# Altium schematic sheet power.SchDoc
size A4
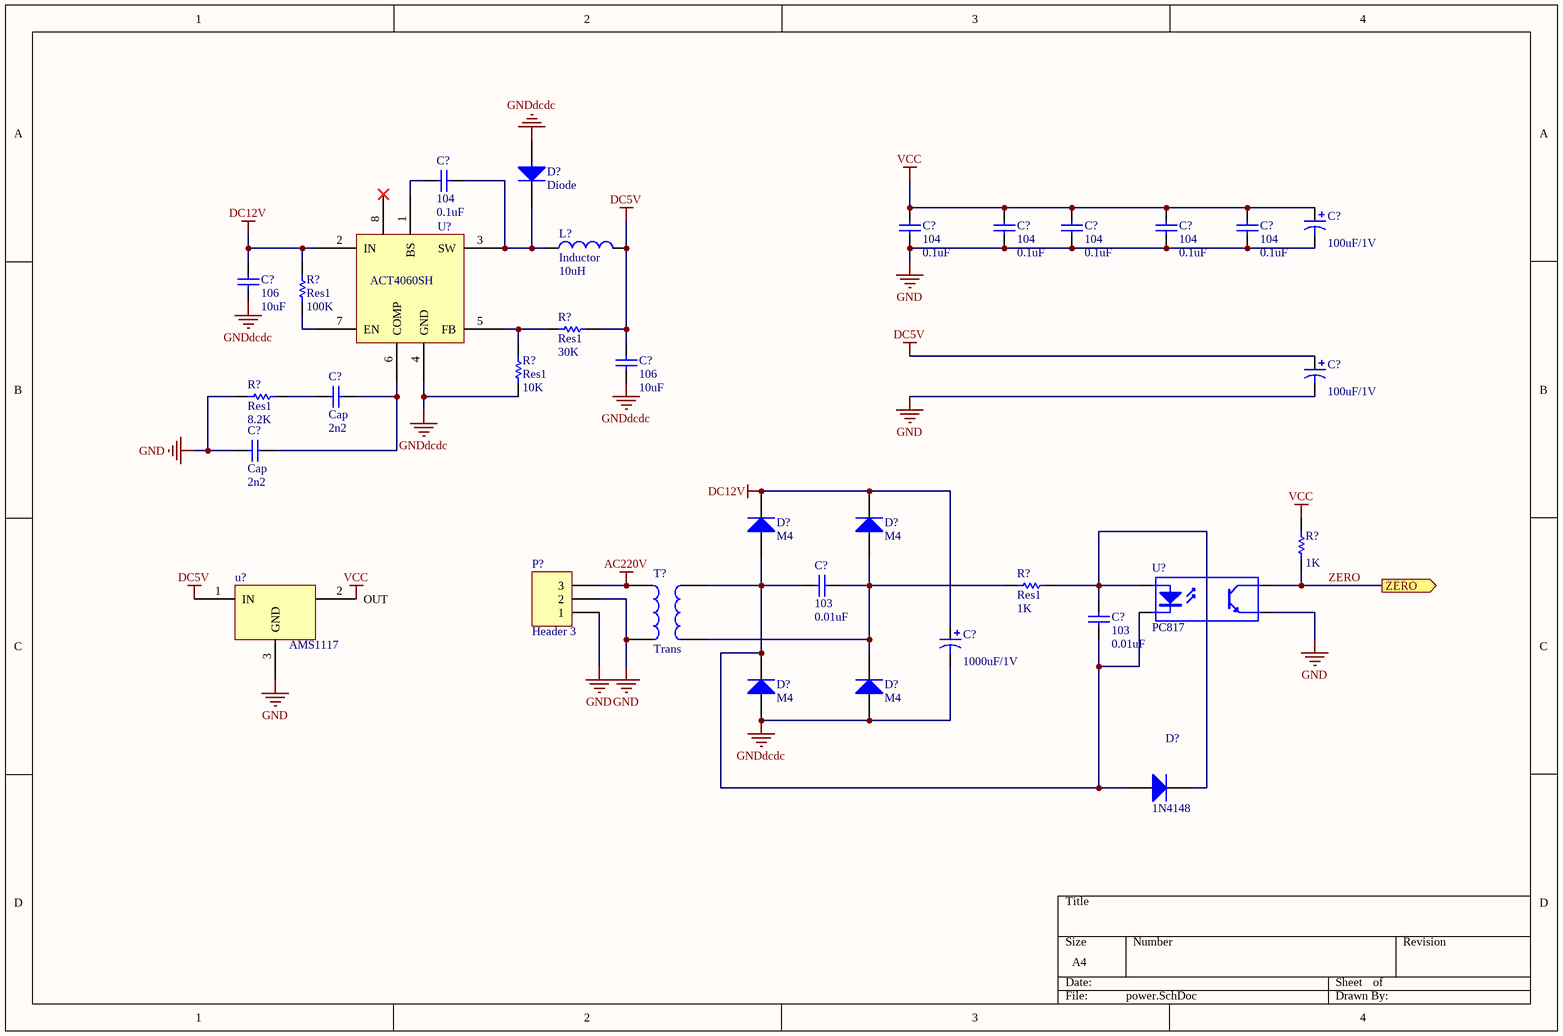
[diagram p0: power.SchDoc]

## Parts
(Parts that share a designator on the sheet are numbered #1, #2 ... from top to bottom, then left to right.)
C?#1  104  value 0.1uF  [RAD-0.3]
C?#2  value 100uF/1V  [RB7.6-15]  (hidden comment: Cap Pol1)
C?#3  104  value 0.1uF  [RAD-0.3]
C?#4  104  value 0.1uF  [RAD-0.3]
C?#5  104  value 0.1uF  [RAD-0.3]
C?#6  104  value 0.1uF  [RAD-0.3]
C?#7  104  value 0.1uF  [RAD-0.3]
C?#8  106  value 10uF  [RAD-0.3]
C?#9  106  value 10uF  [RAD-0.3]
C?#10  value 100uF/1V  [RB7.6-15]  (hidden comment: Cap Pol1)
C?#11  Cap  value 2n2  [RAD-0.3]
C?#12  Cap  value 2n2  [RAD-0.3]
C?#13  103  value 0.01uF  [RAD-0.3]
C?#14  103  value 0.01uF  [RAD-0.3]
C?#15  value 1000uF/1V  [RB7.6-15]  (hidden comment: Cap Pol1)
D?#1  Diode  [SMC]
D?#2  M4  [SMC]
D?#3  M4  [SMC]
D?#4  M4  [SMC]
D?#5  M4  [SMC]
D?#6  1N4148  [DO-35]
L?  Inductor  value 10uH  [0402-A]
P?  Header 3  [HDR1X3]
R?#1  Res1  value 100K  [AXIAL-0.3]
R?#2  Res1  value 30K  [AXIAL-0.3]
R?#3  Res1  value 8.2K  [AXIAL-0.3]
R?#4  Res1  value 10K  [AXIAL-0.3]
R?#5  value 1K  [AXIAL-0.3]  (hidden comment: Res1)
R?#6  Res1  value 1K  [AXIAL-0.3]
T?  Trans  [TRANS]
U?#1  ACT4060SH
U?#2  PC817  [DIP-4]
u?#3  AMS1117

## Ports
ZERO (out)

## Nets
AC220V: P?.3 T?.1
DC5V: C?#9.1 C?#10.1 L?.2 R?#2.2 u?#3.1(IN)
DC12V: C?#8.2 C?#15.1 D?#2.2(K) D?#3.2(K) R?#1.2 U?#1.2(IN)
GND: C?#2.2 C?#3.1 C?#4.1 C?#5.1 C?#6.1 C?#7.1 C?#10.2 C?#12.1 P?.1 P?.2 R?#3.1 T?.2 U?#2.3(E) u?#3.3(GND)
GNDdcdc: C?#8.1 C?#9.2 C?#15.2 D?#1.1(A) D?#4.1(A) D?#5.1(A) R?#4.1 U?#1.4(GND)
VCC: C?#2.1 C?#3.2 C?#4.2 C?#5.2 C?#6.2 C?#7.2 R?#5.2
ZERO: R?#5.1 U?#2.4(C) ; port ZERO
NetC?#1_1: C?#1.1 U?#1.1(BS)
NetC?#1_2: C?#1.2 D?#1.2(K) L?.1 U?#1.3(SW)
NetC?#11_1: C?#11.1 C?#12.2 U?#1.6(COMP)
NetC?#11_2: C?#11.2 R?#3.2
NetC?#13_1: C?#13.1 C?#14.1 D?#2.1(A) D?#4.2(K) D?#6.1(A) T?.3 U?#2.2(K)
NetC?#13_2: C?#13.2 D?#3.1(A) D?#5.2(K) R?#6.1 T?.4
NetC?#14_2: C?#14.2 D?#6.2(K) R?#6.2 U?#2.1(A)
NetR?#1_1: R?#1.1 U?#1.7(EN)
NetR?#2_1: R?#2.1 R?#4.2 U?#1.5(FB)

Not connected (* = marked no-connect by the designer): U?#1 8*; u?#3 2(OUT)

## Notes on the sheet
- Labels drawn without touching a wire or pin: VCC

## Library data of the parts
C?#1 C?#3-C?#9 C?#11-C?#14 = Cap: Capacitor; Published: 8-Jun-2000; LatestRevisionDate: 17-Jul-2002; LatestRevisionNote: Re-released for DXP Platform.; PackageReference: RAD-0.3; Publisher: Altium Limited; PackageDescription: Radial Cap, Thru-Hole; 2 Leads; 0.3 in Pin Spacing
C?#2 C?#10 C?#15 = Cap Pol1: Polarized Capacitor (Radial); Published: 8-Jun-2000; LatestRevisionDate: 17-Jul-2002; LatestRevisionNote: Re-released for DXP Platform.; PackageReference: RB7.6-15; Publisher: Altium Limited; PackageDescription: Polarized Capacitor (Radial); 2 Leads
D?#1-D?#5 = Diode: Default Diode; Published: 8-Jun-2000; LatestRevisionDate: 17-Jul-2002; LatestRevisionNote: Re-released for DXP Platform.; PackageVersion: Sep-1996; PackageReference: SMC; Publisher: Altium Limited; PackageDescription: DO-214-AB/SMC; 2 C-Bend Leads; Body 7.9 x 5.9 mm, inc. leads (LxW); Code_JEDEC: DO-214-AB
D?#6 = Diode 1N4148: High Conductance Fast Diode; Published: 8-Jun-2000; LatestRevisionDate: 17-Jul-2002; LatestRevisionNote: Re-released for DXP Platform.; DatasheetVersion: 1997; PackageReference: DO-35; Publisher: Altium Limited; PackageDescription: Diode, Axial; Body 3.8 x 1.9 mm (LxDia. max), Lead Dia. 0.53 mm (max); Code_JEDEC: DO-204-AH; ComponentLink1Description: Manufacturer Link; ComponentLink1URL: http://www.fairchildsemi.com/; ComponentLink2Description: Datasheet; ComponentLink2URL: http://www.fairchildsemi.com/ds/1N%2F1N4148.pdf
L? = Inductor: Code_IEC: 1005; Published: 8-Jun-2000; LatestRevisionDate: 29-May-2009; LatestRevisionNote: IPC-7351 Footprint Added.; PackageReference: 0402-A; Publisher: Altium Limited; PackageDescription: Chip Inductor; Code_JEITA: 0402
P? = Header 3: Header, 3-Pin; LatestRevisionDate: 17-Jul-2002; LatestRevisionNote: Re-released for DXP Platform.; Publisher: Altium Limited
R?#1-R?#6 = Res1: Resistor; Published: 8-Jun-2000; LatestRevisionDate: 17-Jul-2002; LatestRevisionNote: Re-released for DXP Platform.; PackageReference: AXIAL-0.3; Publisher: Altium Limited; PackageDescription: Axial Device, Thru-Hole; 2 Leads; 0.3 in Pin Spacing
T? = Trans: Transformer; Published: 24-Mar-1999; LatestRevisionDate: 08-Jul-2005; LatestRevisionNote: Mech Layer 1 removed.; PackageReference: TRANS; Publisher: Altium Limited; PackageDescription: Transformer; 4 Leads
U?#2 = Optoisolator1: 4-Pin Phototransistor Optocoupler; Published: 24-Mar-1999; LatestRevisionDate: 04-Mar-2005; LatestRevisionNote: Sch pins 3 & 4 Swapped.; DatasheetVersion: Nov-2003; PackageReference: DIP-4; Publisher: Altium Limited